# Altium schematic sheet ETHERNET.SchDoc
size 594 x 420 mm; SheetNumber: 18; SheetTotal: 20
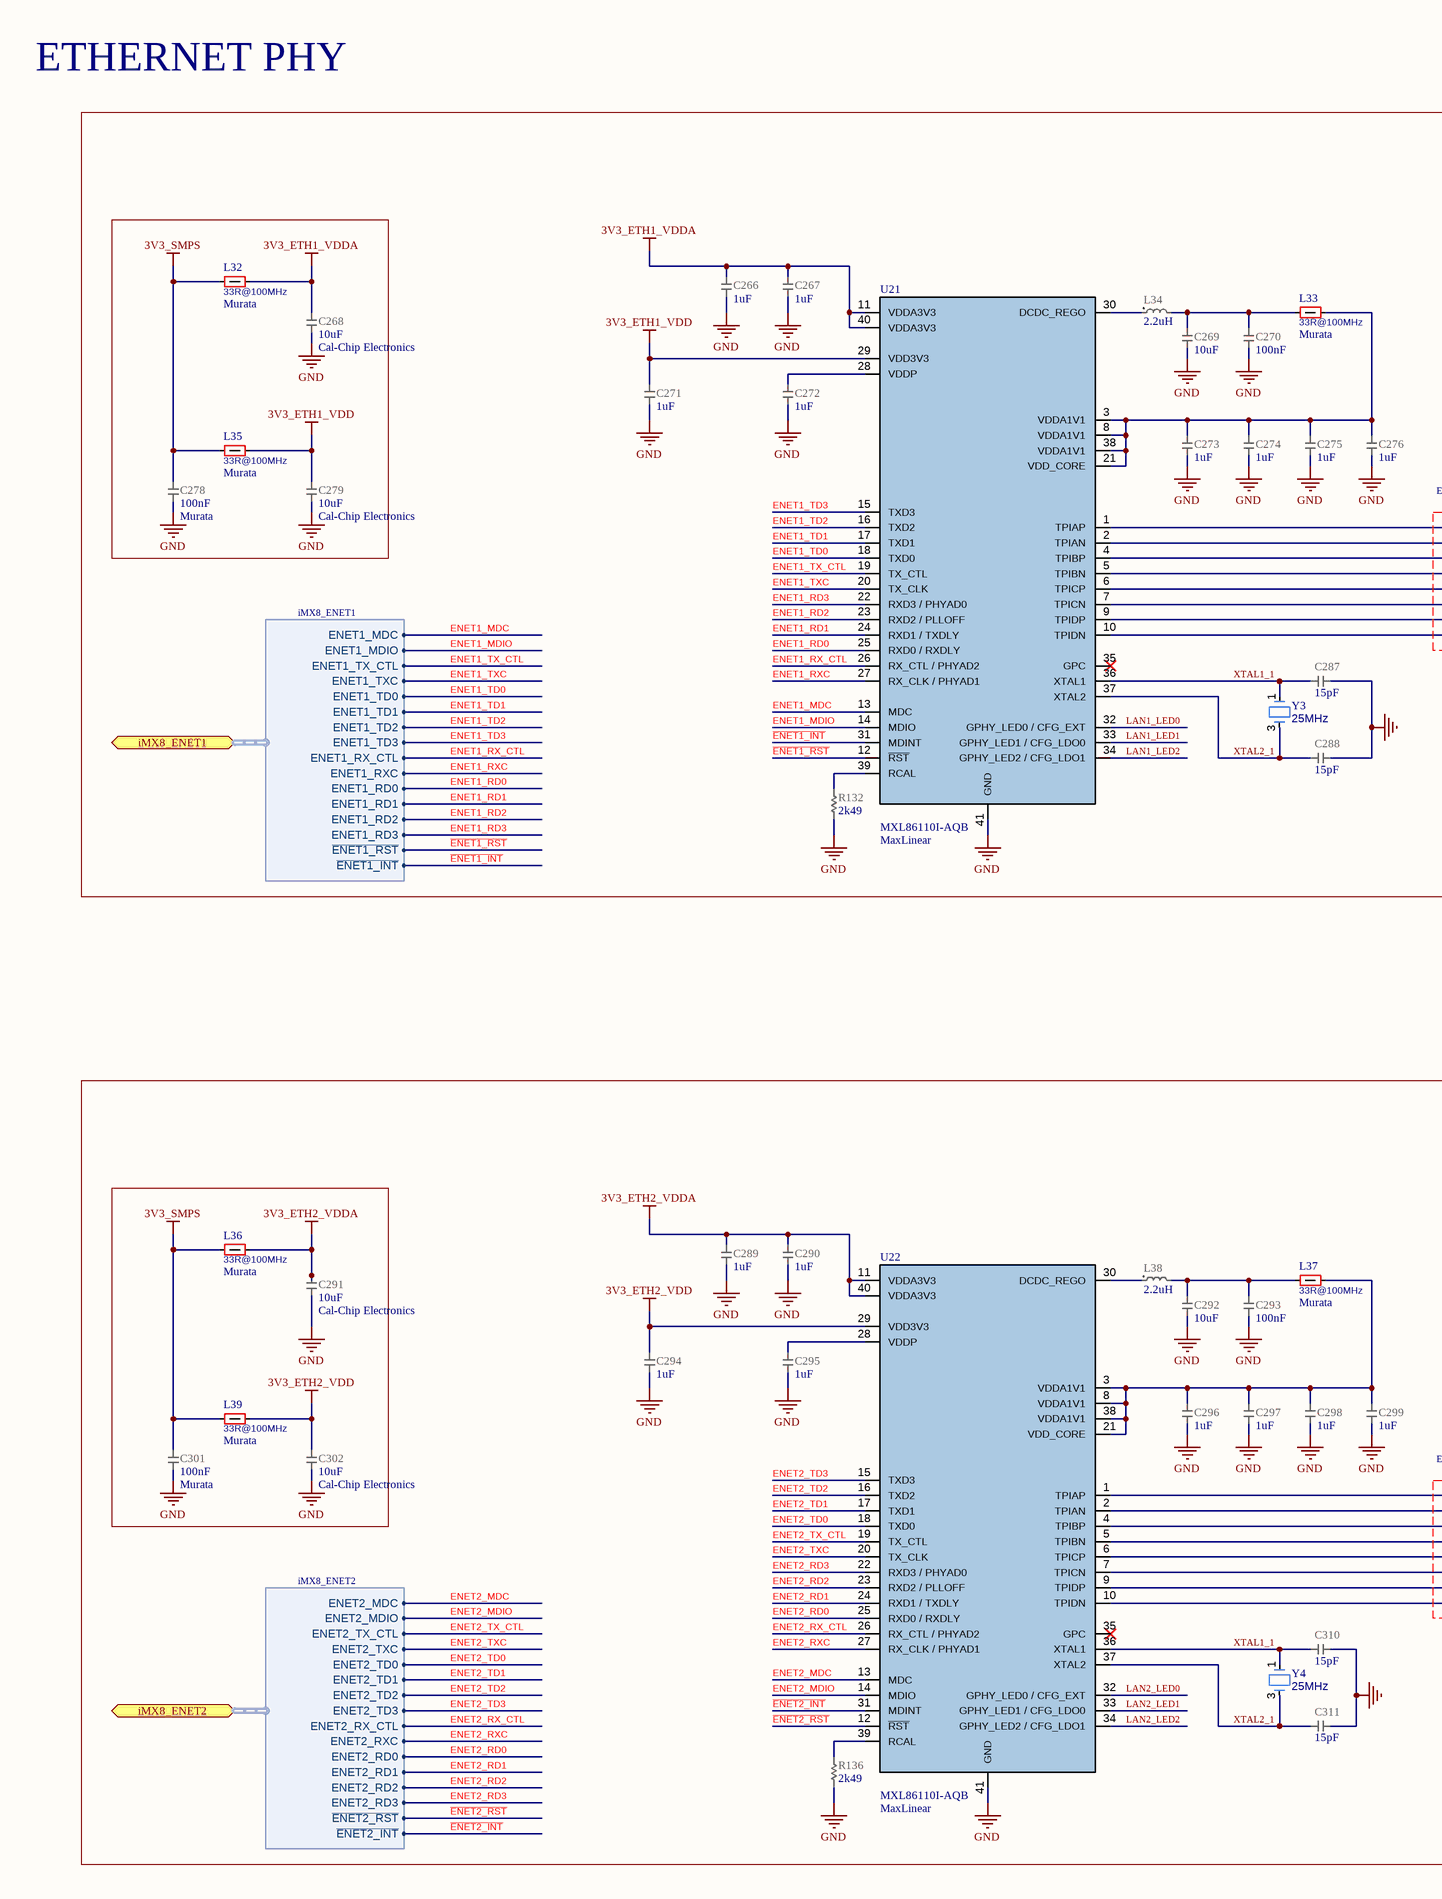
[diagram p0: ETHERNET.SchDoc, left]
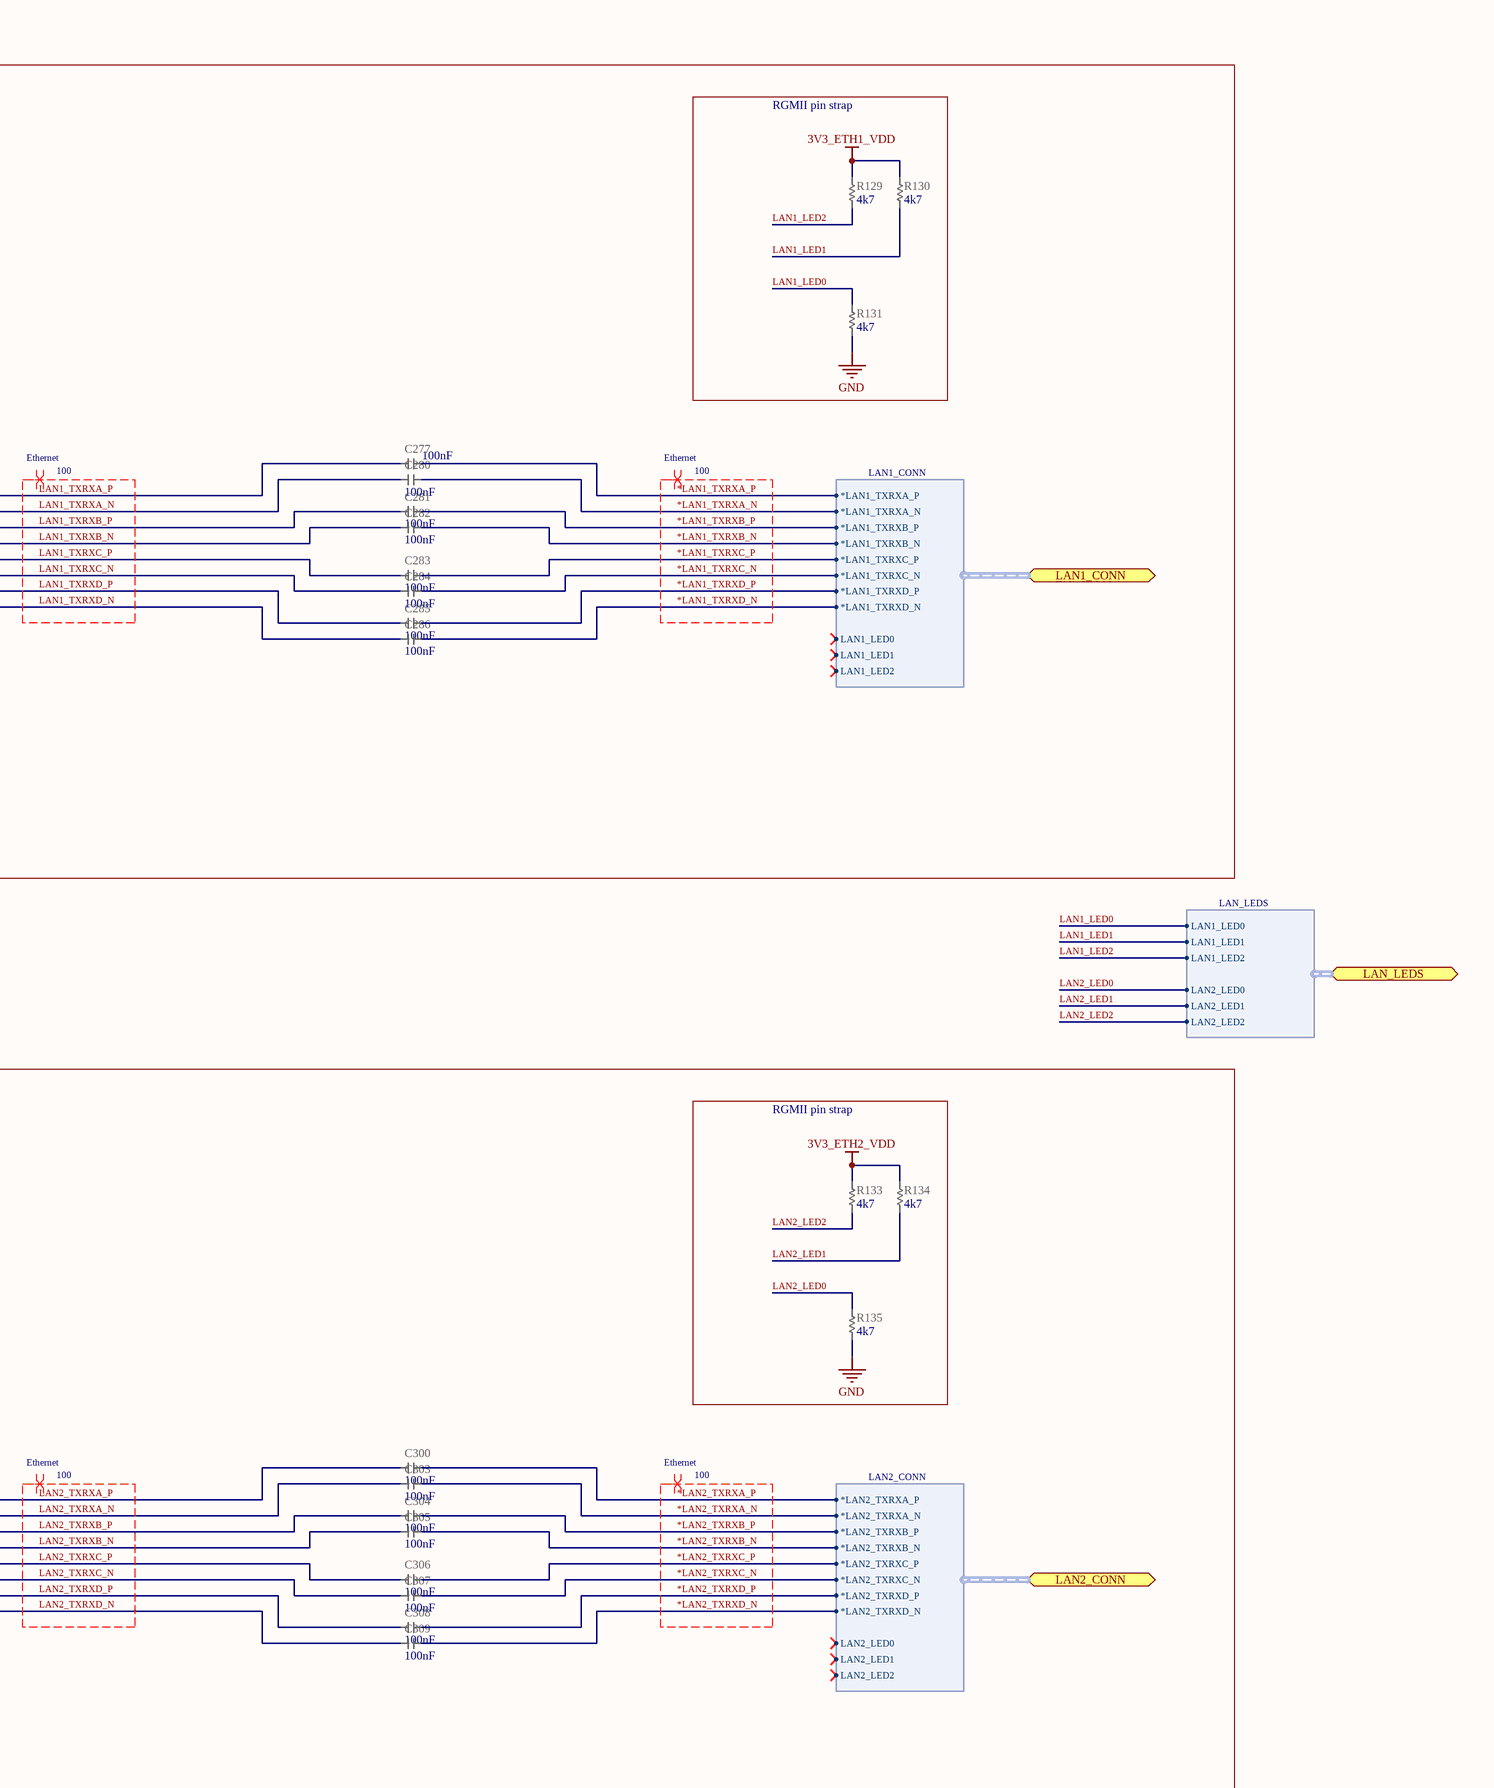
[diagram p1: ETHERNET.SchDoc, right]

## Parts
C266  value 1uF  [CAP_0201_UN1Q]  (hidden comment: CAP_0201_1uF_X6S)
C267  value 1uF  [CAP_0201_UN1Q]  (hidden comment: CAP_0201_1uF_X6S)
C268  value 10uF  Manufacturer: Cal-Chip Electronics  [CAP_0402_H09W07_UN1Q]  (hidden comment: CAP_0402_10u_X6S)
C269  value 10uF  [CAP_0402_H09W07_UN1Q]  (hidden comment: CAP_0402_10u_X6S)
C270  value 100nF  [CAP_0201_UN1Q]  (hidden comment: CAP_0201_100n_X7S_16V)
C271  value 1uF  [CAP_0201_UN1Q]  (hidden comment: CAP_0201_1uF_X6S)
C272  value 1uF  [CAP_0201_UN1Q]  (hidden comment: CAP_0201_1uF_X6S)
C273  value 1uF  [CAP_0201_UN1Q]  (hidden comment: CAP_0201_1uF_X6S)
C274  value 1uF  [CAP_0201_UN1Q]  (hidden comment: CAP_0201_1uF_X6S)
C275  value 1uF  [CAP_0201_UN1Q]  (hidden comment: CAP_0201_1uF_X6S)
C276  value 1uF  [CAP_0201_UN1Q]  (hidden comment: CAP_0201_1uF_X6S)
C277  value 100nF  [CAP_0201_UN1Q]  (hidden comment: CAP_0201_100n_X7S_16V)
C278  value 100nF  Manufacturer: Murata  [CAP_0201_UN1Q]  (hidden comment: CAP_0201_100n_X7S_16V)
C279  value 10uF  Manufacturer: Cal-Chip Electronics  [CAP_0402_H09W07_UN1Q]  (hidden comment: CAP_0402_10u_X6S)
C280  value 100nF  [CAP_0201_UN1Q]  (hidden comment: CAP_0201_100n_X7S_16V)
C281  value 100nF  [CAP_0201_UN1Q]  (hidden comment: CAP_0201_100n_X7S_16V)
C282  value 100nF  [CAP_0201_UN1Q]  (hidden comment: CAP_0201_100n_X7S_16V)
C283  value 100nF  [CAP_0201_UN1Q]  (hidden comment: CAP_0201_100n_X7S_16V)
C284  value 100nF  [CAP_0201_UN1Q]  (hidden comment: CAP_0201_100n_X7S_16V)
C285  value 100nF  [CAP_0201_UN1Q]  (hidden comment: CAP_0201_100n_X7S_16V)
C286  value 100nF  [CAP_0201_UN1Q]  (hidden comment: CAP_0201_100n_X7S_16V)
C287  value 15pF  [CAP_0201_UN1Q]  (hidden comment: CAP_0201_15p)
C288  value 15pF  [CAP_0201_UN1Q]  (hidden comment: CAP_0201_15p)
C289  value 1uF  [CAP_0201_UN1Q]  (hidden comment: CAP_0201_1uF_X6S)
C290  value 1uF  [CAP_0201_UN1Q]  (hidden comment: CAP_0201_1uF_X6S)
C291  value 10uF  Manufacturer: Cal-Chip Electronics  [CAP_0402_H09W07_UN1Q]  (hidden comment: CAP_0402_10u_X6S)
C292  value 10uF  [CAP_0402_H09W07_UN1Q]  (hidden comment: CAP_0402_10u_X6S)
C293  value 100nF  [CAP_0201_UN1Q]  (hidden comment: CAP_0201_100n_X7S_16V)
C294  value 1uF  [CAP_0201_UN1Q]  (hidden comment: CAP_0201_1uF_X6S)
C295  value 1uF  [CAP_0201_UN1Q]  (hidden comment: CAP_0201_1uF_X6S)
C296  value 1uF  [CAP_0201_UN1Q]  (hidden comment: CAP_0201_1uF_X6S)
C297  value 1uF  [CAP_0201_UN1Q]  (hidden comment: CAP_0201_1uF_X6S)
C298  value 1uF  [CAP_0201_UN1Q]  (hidden comment: CAP_0201_1uF_X6S)
C299  value 1uF  [CAP_0201_UN1Q]  (hidden comment: CAP_0201_1uF_X6S)
C300  value 100nF  [CAP_0201_UN1Q]  (hidden comment: CAP_0201_100n_X7S_16V)
C301  value 100nF  Manufacturer: Murata  [CAP_0201_UN1Q]  (hidden comment: CAP_0201_100n_X7S_16V)
C302  value 10uF  Manufacturer: Cal-Chip Electronics  [CAP_0402_H09W07_UN1Q]  (hidden comment: CAP_0402_10u_X6S)
C303  value 100nF  [CAP_0201_UN1Q]  (hidden comment: CAP_0201_100n_X7S_16V)
C304  value 100nF  [CAP_0201_UN1Q]  (hidden comment: CAP_0201_100n_X7S_16V)
C305  value 100nF  [CAP_0201_UN1Q]  (hidden comment: CAP_0201_100n_X7S_16V)
C306  value 100nF  [CAP_0201_UN1Q]  (hidden comment: CAP_0201_100n_X7S_16V)
C307  value 100nF  [CAP_0201_UN1Q]  (hidden comment: CAP_0201_100n_X7S_16V)
C308  value 100nF  [CAP_0201_UN1Q]  (hidden comment: CAP_0201_100n_X7S_16V)
C309  value 100nF  [CAP_0201_UN1Q]  (hidden comment: CAP_0201_100n_X7S_16V)
C310  value 15pF  [CAP_0201_UN1Q]  (hidden comment: CAP_0201_15p)
C311  value 15pF  [CAP_0201_UN1Q]  (hidden comment: CAP_0201_15p)
L32  value 33R@100MHz  Manufacturer: Murata  [IND_0201_UN1Q]  (hidden comment: FERRITE_0201_BLM03_33Ohm)
L33  value 33R@100MHz  Manufacturer: Murata  [IND_0201_UN1Q]  (hidden comment: FERRITE_0201_BLM03_33Ohm)
L34  value 2.2uH  [IND_74479335329222_353220]  (hidden comment: IND_74479335329222_2u2)
L35  value 33R@100MHz  Manufacturer: Murata  [IND_0201_UN1Q]  (hidden comment: FERRITE_0201_BLM03_33Ohm)
L36  value 33R@100MHz  Manufacturer: Murata  [IND_0201_UN1Q]  (hidden comment: FERRITE_0201_BLM03_33Ohm)
L37  value 33R@100MHz  Manufacturer: Murata  [IND_0201_UN1Q]  (hidden comment: FERRITE_0201_BLM03_33Ohm)
L38  value 2.2uH  [IND_74479335329222_353220]  (hidden comment: IND_74479335329222_2u2)
L39  value 33R@100MHz  Manufacturer: Murata  [IND_0201_UN1Q]  (hidden comment: FERRITE_0201_BLM03_33Ohm)
R129  value 4k7  [RES_0201_UN1Q]  (hidden comment: RES_0201_4k7)
R130  value 4k7  [RES_0201_UN1Q]  (hidden comment: RES_0201_4k7)
R131  value 4k7  [RES_0201_UN1Q]  (hidden comment: RES_0201_4k7)
R132  value 2k49  [RES_0201_UN1Q]  (hidden comment: RES_0201_2k49)
R133  value 4k7  [RES_0201_UN1Q]  (hidden comment: RES_0201_4k7)
R134  value 4k7  [RES_0201_UN1Q]  (hidden comment: RES_0201_4k7)
R135  value 4k7  [RES_0201_UN1Q]  (hidden comment: RES_0201_4k7)
R136  value 2k49  [RES_0201_UN1Q]  (hidden comment: RES_0201_2k49)
U21  Manufacturer: MaxLinear  [QFN40_5x5mm]  (hidden comment: MXL86110I-AQB)
U22  Manufacturer: MaxLinear  [QFN40_5x5mm]  (hidden comment: MXL86110I-AQB)
Y3  value 25MHz  [XTAL_2016_UN1Q]  (hidden comment: XTAL_25M_ECS_2016_4-SMD)
Y4  value 25MHz  [XTAL_2016_UN1Q]  (hidden comment: XTAL_25M_ECS_2016_4-SMD)

## Blocks framed on the sheet
RGMII pin strap: R129-R131
RGMII pin strap: R133-R135

## Ports
iMX8_ENET1 (bidir, harness iMX8_ENET1), iMX8_ENET2 (bidir, harness iMX8_ENET2), LAN1_CONN (bidir, harness LAN1_CONN), LAN2_CONN (bidir, harness LAN2_CONN), LAN_LEDS (bidir, harness LAN_LEDS)

## Harnesses
iMX8_ENET1: ENET1_MDC, ENET1_MDIO, ENET1_TX_CTL, ENET1_TXC, ENET1_TD0, ENET1_TD1, ENET1_TD2, ENET1_TD3, ENET1_RX_CTL, ENET1_RXC, ENET1_RD0, ENET1_RD1, ENET1_RD2, ENET1_RD3, ~{ENET1_RST}, ~{ENET1_INT}
iMX8_ENET2: ENET2_MDC, ENET2_MDIO, ENET2_TX_CTL, ENET2_TXC, ENET2_TD0, ENET2_TD1, ENET2_TD2, ENET2_TD3, ENET2_RX_CTL, ENET2_RXC, ENET2_RD0, ENET2_RD1, ENET2_RD2, ENET2_RD3, ~{ENET2_RST}, ~{ENET2_INT}
LAN1_CONN: LAN1_LED0, LAN1_LED1, LAN1_LED2, *LAN1_TXRXA_P, *LAN1_TXRXA_N, *LAN1_TXRXB_P, *LAN1_TXRXB_N, *LAN1_TXRXC_P, *LAN1_TXRXC_N, *LAN1_TXRXD_P, *LAN1_TXRXD_N
LAN2_CONN: LAN2_LED0, LAN2_LED1, LAN2_LED2, *LAN2_TXRXA_P, *LAN2_TXRXA_N, *LAN2_TXRXB_P, *LAN2_TXRXB_N, *LAN2_TXRXC_P, *LAN2_TXRXC_N, *LAN2_TXRXD_P, *LAN2_TXRXD_N
LAN_LEDS: LAN1_LED0, LAN1_LED1, LAN1_LED2, LAN2_LED0, LAN2_LED1, LAN2_LED2

## Nets
3V3_ETH1_VDD: C271.2 C279.2 L35.2 R129.2 R130.2 U21.29(VDD3V3)
3V3_ETH1_VDDA: C266.2 C267.2 C268.2 L32.2 U21.11(VDDA3V3) U21.40(VDDA3V3)
3V3_ETH2_VDD: C294.2 C302.2 L39.2 R133.2 R134.2 U22.29(VDD3V3)
3V3_ETH2_VDDA: C289.2 C290.2 C291.2 L36.2 U22.11(VDDA3V3) U22.40(VDDA3V3)
3V3_SMPS: C278.2 C301.2 L32.1 L35.1 L36.1 L39.1
GND: C266.1 C267.1 C268.1 C269.2 C270.1 C271.1 C272.1 C273.1 C274.1 C275.1 C276.1 C278.1 C279.1 C287.2 C288.2 C289.1 C290.1 C291.1 C292.2 C293.1 C294.1 C295.1 C296.1 C297.1 C298.1 C299.1 C301.1 C302.1 C310.2 C311.2 R131.1 R132.1 R135.1 R136.1 U21.41(GND) U22.41(GND) Y3.2(GND) Y3.4(GND) Y4.2(GND) Y4.4(GND)
*LAN1_TXRXA_N: C280.2 ; port LAN1_CONN.*LAN1_TXRXA_N
*LAN1_TXRXA_P: C277.2 ; port LAN1_CONN.*LAN1_TXRXA_P
*LAN1_TXRXB_N: C282.2 ; port LAN1_CONN.*LAN1_TXRXB_N
*LAN1_TXRXB_P: C281.2 ; port LAN1_CONN.*LAN1_TXRXB_P
*LAN1_TXRXC_N: C284.2 ; port LAN1_CONN.*LAN1_TXRXC_N
*LAN1_TXRXC_P: C283.2 ; port LAN1_CONN.*LAN1_TXRXC_P
*LAN1_TXRXD_N: C286.2 ; port LAN1_CONN.*LAN1_TXRXD_N
*LAN1_TXRXD_P: C285.2 ; port LAN1_CONN.*LAN1_TXRXD_P
*LAN2_TXRXA_N: C303.2 ; port LAN2_CONN.*LAN2_TXRXA_N
*LAN2_TXRXA_P: C300.2 ; port LAN2_CONN.*LAN2_TXRXA_P
*LAN2_TXRXB_N: C305.2 ; port LAN2_CONN.*LAN2_TXRXB_N
*LAN2_TXRXB_P: C304.2 ; port LAN2_CONN.*LAN2_TXRXB_P
*LAN2_TXRXC_N: C307.2 ; port LAN2_CONN.*LAN2_TXRXC_N
*LAN2_TXRXC_P: C306.2 ; port LAN2_CONN.*LAN2_TXRXC_P
*LAN2_TXRXD_N: C309.2 ; port LAN2_CONN.*LAN2_TXRXD_N
*LAN2_TXRXD_P: C308.2 ; port LAN2_CONN.*LAN2_TXRXD_P
~{ENET1_INT}: U21.31(MDINT) ; port iMX8_ENET1.~{ENET1_INT}
~{ENET1_RST}: U21.12(~{RST}) ; port iMX8_ENET1.~{ENET1_RST}
~{ENET2_INT}: U22.31(MDINT) ; port iMX8_ENET2.~{ENET2_INT}
~{ENET2_RST}: U22.12(~{RST}) ; port iMX8_ENET2.~{ENET2_RST}
ENET1_MDC: U21.13(MDC) ; port iMX8_ENET1.ENET1_MDC
ENET1_MDIO: U21.14(MDIO) ; port iMX8_ENET1.ENET1_MDIO
ENET1_RD0: U21.25(RXD0_/_RXDLY) ; port iMX8_ENET1.ENET1_RD0
ENET1_RD1: U21.24(RXD1_/_TXDLY) ; port iMX8_ENET1.ENET1_RD1
ENET1_RD2: U21.23(RXD2_/_PLLOFF) ; port iMX8_ENET1.ENET1_RD2
ENET1_RD3: U21.22(RXD3_/_PHYAD0) ; port iMX8_ENET1.ENET1_RD3
ENET1_RX_CTL: U21.26(RX_CTL_/_PHYAD2) ; port iMX8_ENET1.ENET1_RX_CTL
ENET1_RXC: U21.27(RX_CLK_/_PHYAD1) ; port iMX8_ENET1.ENET1_RXC
ENET1_TD0: U21.18(TXD0) ; port iMX8_ENET1.ENET1_TD0
ENET1_TD1: U21.17(TXD1) ; port iMX8_ENET1.ENET1_TD1
ENET1_TD2: U21.16(TXD2) ; port iMX8_ENET1.ENET1_TD2
ENET1_TD3: U21.15(TXD3) ; port iMX8_ENET1.ENET1_TD3
ENET1_TX_CTL: U21.19(TX_CTL) ; port iMX8_ENET1.ENET1_TX_CTL
ENET1_TXC: U21.20(TX_CLK) ; port iMX8_ENET1.ENET1_TXC
ENET2_MDC: U22.13(MDC) ; port iMX8_ENET2.ENET2_MDC
ENET2_MDIO: U22.14(MDIO) ; port iMX8_ENET2.ENET2_MDIO
ENET2_RD0: U22.25(RXD0_/_RXDLY) ; port iMX8_ENET2.ENET2_RD0
ENET2_RD1: U22.24(RXD1_/_TXDLY) ; port iMX8_ENET2.ENET2_RD1
ENET2_RD2: U22.23(RXD2_/_PLLOFF) ; port iMX8_ENET2.ENET2_RD2
ENET2_RD3: U22.22(RXD3_/_PHYAD0) ; port iMX8_ENET2.ENET2_RD3
ENET2_RX_CTL: U22.26(RX_CTL_/_PHYAD2) ; port iMX8_ENET2.ENET2_RX_CTL
ENET2_RXC: U22.27(RX_CLK_/_PHYAD1) ; port iMX8_ENET2.ENET2_RXC
ENET2_TD0: U22.18(TXD0) ; port iMX8_ENET2.ENET2_TD0
ENET2_TD1: U22.17(TXD1) ; port iMX8_ENET2.ENET2_TD1
ENET2_TD2: U22.16(TXD2) ; port iMX8_ENET2.ENET2_TD2
ENET2_TD3: U22.15(TXD3) ; port iMX8_ENET2.ENET2_TD3
ENET2_TX_CTL: U22.19(TX_CTL) ; port iMX8_ENET2.ENET2_TX_CTL
ENET2_TXC: U22.20(TX_CLK) ; port iMX8_ENET2.ENET2_TXC
LAN1_LED0: R131.2 U21.32(GPHY_LED0_/_CFG_EXT) ; port LAN_LEDS.LAN1_LED0
LAN1_LED1: R130.1 U21.33(GPHY_LED1_/_CFG_LDO0) ; port LAN_LEDS.LAN1_LED1
LAN1_LED2: R129.1 U21.34(GPHY_LED2_/_CFG_LDO1) ; port LAN_LEDS.LAN1_LED2
LAN1_TXRXA_N: C280.1 U21.2(TPIAN)
LAN1_TXRXA_P: C277.1 U21.1(TPIAP)
LAN1_TXRXB_N: C282.1 U21.5(TPIBN)
LAN1_TXRXB_P: C281.1 U21.4(TPIBP)
LAN1_TXRXC_N: C284.1 U21.7(TPICN)
LAN1_TXRXC_P: C283.1 U21.6(TPICP)
LAN1_TXRXD_N: C286.1 U21.10(TPIDN)
LAN1_TXRXD_P: C285.1 U21.9(TPIDP)
LAN2_LED0: R135.2 U22.32(GPHY_LED0_/_CFG_EXT) ; port LAN_LEDS.LAN2_LED0
LAN2_LED1: R134.1 U22.33(GPHY_LED1_/_CFG_LDO0) ; port LAN_LEDS.LAN2_LED1
LAN2_LED2: R133.1 U22.34(GPHY_LED2_/_CFG_LDO1) ; port LAN_LEDS.LAN2_LED2
LAN2_TXRXA_N: C303.1 U22.2(TPIAN)
LAN2_TXRXA_P: C300.1 U22.1(TPIAP)
LAN2_TXRXB_N: C305.1 U22.5(TPIBN)
LAN2_TXRXB_P: C304.1 U22.4(TPIBP)
LAN2_TXRXC_N: C307.1 U22.7(TPICN)
LAN2_TXRXC_P: C306.1 U22.6(TPICP)
LAN2_TXRXD_N: C309.1 U22.10(TPIDN)
LAN2_TXRXD_P: C308.1 U22.9(TPIDP)
XTAL1_1: C287.1 C310.1 U21.36(XTAL1) U22.36(XTAL1) Y3.1 Y4.1
XTAL2_1: C288.1 C311.1 U21.37(XTAL2) U22.37(XTAL2) Y3.3 Y4.3
NetC269_1: C269.1 C270.2 L33.1 L34.2
NetC272_2: C272.2 U21.28(VDDP)
NetC273_2: C273.2 C274.2 C275.2 C276.2 L33.2 U21.3(VDDA1V1) U21.8(VDDA1V1) U21.21(VDD_CORE) U21.38(VDDA1V1)
NetC292_1: C292.1 C293.2 L37.1 L38.2
NetC295_2: C295.2 U22.28(VDDP)
NetC296_2: C296.2 C297.2 C298.2 C299.2 L37.2 U22.3(VDDA1V1) U22.8(VDDA1V1) U22.21(VDD_CORE) U22.38(VDDA1V1)
NetL34_1: L34.1 U21.30(DCDC_REGO)
NetL38_1: L38.1 U22.30(DCDC_REGO)
NetR132_2: R132.2 U21.39(RCAL)
NetR136_2: R136.2 U22.39(RCAL)

Not connected (* = marked no-connect by the designer): U21 35(GPC)*; U22 35(GPC)*

## Layout directives
differential pair; net class Ethernet; differential pair class 100; rule Matched Net Lengths [Tolerance = 0.4mm]: *LAN1_TXRXA_N, *LAN1_TXRXA_P, *LAN1_TXRXB_N, *LAN1_TXRXB_P, *LAN1_TXRXC_N, *LAN1_TXRXC_P, *LAN1_TXRXD_N, *LAN1_TXRXD_P, *LAN2_TXRXA_N, *LAN2_TXRXA_P, *LAN2_TXRXB_N, *LAN2_TXRXB_P, *LAN2_TXRXC_N, *LAN2_TXRXC_P, *LAN2_TXRXD_N, *LAN2_TXRXD_P, LAN1_TXRXA_N, LAN1_TXRXA_P, LAN1_TXRXB_N, LAN1_TXRXB_P, LAN1_TXRXC_N, LAN1_TXRXC_P, LAN1_TXRXD_N, LAN1_TXRXD_P, LAN2_TXRXA_N, LAN2_TXRXA_P, LAN2_TXRXB_N, LAN2_TXRXB_P, LAN2_TXRXC_N, LAN2_TXRXC_P, LAN2_TXRXD_N, LAN2_TXRXD_P

## Notes on the sheet
- ETHERNET PHY
- DWG NO:
- REV:
- THIS DOCUMENT AND THE DATA DISCLOSED HEREIN OR
- HEREWITH IS THE PROPERTY OF ALTIUM LIMITED AND MAY
- BE FREELY DISTRIBUTED IN WHOLE. NO RIGHTS ARE
- RESERVED OR EXPRESS OR IMPLIED WARANTEE GIVEN.
- REVISION
- DESCRIPTION
- DATE
- APPROVED
- ENG:
- APPROVALS
- PROJECT
- DSN:
- CHK:
- REFERENCE DOCUMENTS
- PROJECT REVISION:
- TITLE
- DOCUMENT REVISION:
- DESIGN ITEM:
- BOM:
- FAB DWG:
- PCB DWG:
- ASSY DWG:
- SCALE:
- A2
- SIZE
- CAGE CODE
- FILE NAME
- DWG NO.
- SHEET
- OF
- REV

## Library data of the parts
C266 C267 C271-C276 C289 C290 C294-C299 = CMP-001-000336-15: CAP; Part Number: KGM03CS61A105MH; Manufacturer: Kyocera; Manufacturer: KYOCERA AVX; Temperature characteristics: X6S; Voltage: 10V; Tolerance: +/-20%; Sort order: 302; HasBeenBuilt: False; Alternative component: Allowed; System: RLC; Package: 0201; Operating temperature range: -55C to +105C; ComponentLink1Description: 1_Datasheet; ComponentLink2Description: 2_Product page; ComponentLink3Description: 3_X-information; ComponentLink4Description: 4_X-information; Creation date: 20190101; ClassName: SMALL; Source: RLC_UN1Q.SchLib; Manufacturer Part Number: KGM03CS61A105MH; Component Type: Capacitor
C268 C279 C291 C302 = CMP-001-000883-14: CAP; Part Number: GMC04X6S106M6R3NT; Manufacturer: Cal-Chip Electronics, Inc.; Temperature characteristics: X6S; Voltage: 6.3V; Tolerance: +/-20%; Sort order: 304; HasBeenBuilt: TBD; Alternative component: Allowed; System: RLC; Package: 0402; ComponentLink1Description: 1_Datasheet; ComponentLink2Description: 2_Product page; ComponentLink3Description: 3_X-information; ComponentLink4Description: 4_X-information; Creation date: 26042024; Manufacturer Part Number: GMC04X6S106M6R3NT; Component Type: Capacitor
C269 C292 = CMP-001-000883-14: CAP; Part Number: GMC04X6S106M6R3NT; Manufacturer: Cal-Chip Electronics, Inc.; Manufacturer: Cal-Chip Electronics; Temperature characteristics: X6S; Voltage: 6.3V; Tolerance: +/-20%; Sort order: 304; HasBeenBuilt: TBD; Alternative component: Allowed; System: RLC; Package: 0402; ComponentLink1Description: 1_Datasheet; ComponentLink2Description: 2_Product page; ComponentLink3Description: 3_X-information; ComponentLink4Description: 4_X-information; Creation date: 26042024; Manufacturer Part Number: GMC04X6S106M6R3NT; Component Type: Capacitor
C270 C277 C280-C286 C293 C300 C303-C309 = CMP-001-000385-16: CAP; Part Number: GRM033C71C104KE14D; Manufacturer: Murata; Temperature characteristics: X7S; Tolerance: +/-10%; Sort order: 302; HasBeenBuilt: TBD; Alternative component: Allowed; Voltage: 16V; System: RLC; Package: 0201; ClassName: SMALL; ComponentLink1Description: 1_Datasheet; ComponentLink2Description: 2_Product page; ComponentLink3Description: 3_X-information; ComponentLink4Description: 4_X-information; Creation date: 20190101; Source: RLC_UN1Q.SchLib; Manufacturer Part Number: GRM033C71C104KE14D; Component Type: Capacitor
C278 C301 = CMP-001-000385-16: CAP; Part Number: GRM033C71C104KE14D; Temperature characteristics: X7S; Tolerance: +/-10%; Sort order: 302; HasBeenBuilt: TBD; Alternative component: Allowed; Voltage: 16V; System: RLC; Package: 0201; ClassName: SMALL; ComponentLink1Description: 1_Datasheet; ComponentLink2Description: 2_Product page; ComponentLink3Description: 3_X-information; ComponentLink4Description: 4_X-information; Creation date: 20190101; Source: RLC_UN1Q.SchLib; Manufacturer Part Number: GRM033C71C104KE14D; Component Type: Capacitor
C287 C288 C310 C311 = CMP-001-000269-15: CAP; Part Number: GRM0335C1H150JA01D; Manufacturer: Murata; Temperature characteristics: C0G; Voltage: 50V; Tolerance: +/-5%; Sort order: 302; HasBeenBuilt: TBD; Alternative component: Allowed; System: RLC; Package: 0201; ComponentLink1Description: 1_Datasheet; ComponentLink2Description: 2_Product page; ComponentLink3Description: 3_X-information; ComponentLink4Description: 4_X-information; Creation date: 20190101; ClassName: SMALL; Source: RLC_UN1Q.SchLib; Manufacturer Part Number: GRM0335C1H150JA01D; Component Type: Capacitor
L32 L33 L35-L37 L39 = CMP-001-000744-8: FERRITE; Part Number: BLM03PG330SN1; Manufacturer Part Number: BLM03PG330SN1D; Tolerance: 25%; Sort order: 362; HasBeenBuilt: TBD; System: Discrete; Current: 750mA; Package: 0201; Operating temperature range: -55 ... +125C; ClassName: SMALL; ComponentLink1Description: 1_Datasheet; ComponentLink1URL: https://www.murata.com/en-us/products/productdetail.aspx?cate=luNoiseSupprFilteChipFerriBead&partno=BLM03PG330SN1%23; ComponentLink2Description: 2_Product page; ComponentLink3Description: 3_X-information; ComponentLink4Description: 4_X-information; Creation date: 20200304; Source: Discrete_UN1Q.SchLib; Component Type: Ferrite
L34 L38 = CMP-001-001617-1: IND, Low DCR, shielded.; Manufacturer: Wurth; Manufacturer: Wurth Elektronik; Manufacturer Part Number: 74439334047; Sort order: 348; System: RLC; Package: 353220; Dimensions WxLxH: 3.5 x 3.2 x 2.0mm; Part Number: 74479335329222; ComponentLink1Description: 1_Datasheet; ComponentLink1URL: https://www.we-online.com/components/products/datasheet/74479335329222.pdf; ComponentLink2Description: 2_Product_page; ComponentLink2URL: https://www.we-online.com/en/components/products/WE-PMFI#74479335329222; Creation date: 20251029; Operating temperature range: -55°C ~ 150°C; ClassName: BIG; ComponentLink3Description: 3_X-information; ComponentLink4Description: 4_X-information; Component Type: Inductor
R129-R131 R133-R135 = CMP-001-000475-13: RES; Part Number: RC0201FR-074K7L; Manufacturer: YAGEO; Manufacturer: Yageo Group; Power Rating: 1/20W; Sort order: 322; HasBeenBuilt: TBD; Alternative component: Allowed; Tolerance: 1%; System: RLC; Package: 0201; ClassName: SMALL; ComponentLink1Description: 1_Datasheet; ComponentLink2Description: 2_Product page; ComponentLink3Description: 3_X-information; ComponentLink4Description: 4_X-information; Creation date: 20190101; Source: RLC_UN1Q.SchLib; Manufacturer Part Number: RC0201FR-074K7L; Component Type: Resistor
R132 R136 = CMP-001-000561-13: RES; Part Number: RMCF0201FT2K49; Manufacturer: YAGEO; Power Rating: 1/20W; Sort order: 322; HasBeenBuilt: TBD; Alternative component: Allowed; Tolerance: 1%; System: RLC; Package: 0201; ClassName: SMALL; ComponentLink1Description: 1_Datasheet; ComponentLink2Description: 2_Product page; ComponentLink3Description: 3_X-information; ComponentLink4Description: 4_X-information; Creation date: 20230510; Source: RLC_UN1Q.SchLib; Component Type: Resistor
U21 U22 = CMP-031-000173-6: Ethernet PHY, RGMII, 1000BASE-T, 100BASE-TX, 10BASE-Te; Sort order: 501; HasBeenBuilt: False; System: IC; Package: QFN40; Operating temperature range: -40 .... +85 °C; ClassName: BIG; Creation Date: 26032024; ComponentLink1Description: 1_Datasheet; ComponentLink1URL: https://www.maxlinear.com/Document/index?id=23355&productId=14849; ComponentLink2Description: 2_Product_page; ComponentLink2URL: https://www.maxlinear.com/product/interface/ethernet/ethernet-transceivers-phy/mxl86110; ComponentLink3Description: 3_X-information; ComponentLink4Description: 4_X-information; Dimensions WxLxH: 5x5x1mm; Part Number: MXL86110I-AQB; Source: UUDET_KOMPONENTIT.SchLib; Design Item ID: MXL86110I-AQB; Manufacturer Part Number: MXL86110I-AQB; Component Type: Data Converter
Y3 Y4 = CMP-001-000909-8: Crystal 25MHz ±10ppm, 10pF; Part Number: ECS-250-10-37B-CTN; Manufacturer: ECS Inc.; Manufacturer: ECS International; Manufacturer Part Number: ECS-250-10-37B-CTN-TR; Tolerance: +/-10ppm; Sort order: 455; HasBeenBuilt: Cmod2_01; System: Discrete; Operating temperature range: -40 ... +85C; Dimensions WxLxH: 2 x 1.6mm x 0.65mm; Creation date: 20230102; ComponentLink1Description: 1_Datasheet; ComponentLink1URL: https://ecsxtal.com/store/pdf/ECX-1637B.pdf; ComponentLink2Description: 2_Product_page; ComponentLink2URL: https://ecsxtal.com/products/crystals/surface-mount-crystals/ecx-1637b/; ComponentLink3Description: 3_X-information; ComponentLink4Description: 4_X-information; ECCN: EAR99; Source: UUDET_KOMPONENTIT.SchLib; RoHS: RoHS3; Component Type: Crystal & Oscillator